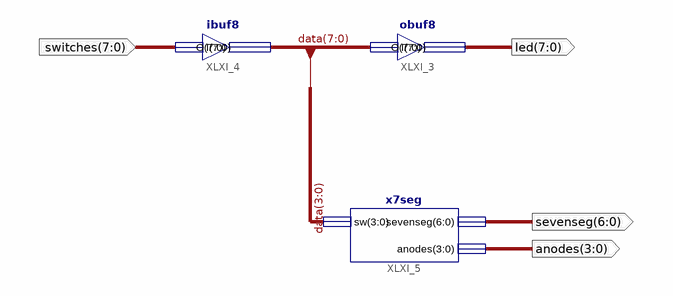
[diagram p0: schematic sheet 1]
// Xilinx ISE schematic toplevel.sch (spartan3e) as structural Verilog: 3 symbols, 4 ports
module toplevel (
  input  [7:0] switches,
  output [7:0] led,
  output [6:0] sevenseg,
  output [3:0] anodes
);

  wire [7:0] data;

  obuf8 XLXI_3 (.I(data), .O(led));
  ibuf8 XLXI_4 (.I(switches), .O(data));
  x7seg XLXI_5 (.sw(data[3:0]), .sevenseg(sevenseg), .anodes(anodes));
endmodule
